# EAGLE design BMS Segment rev16 (EAGLE 9.6.2)
ENGINEER: Arvind Srinivasan

## Sheet 1 of 2: Lower 9 Cell Connections
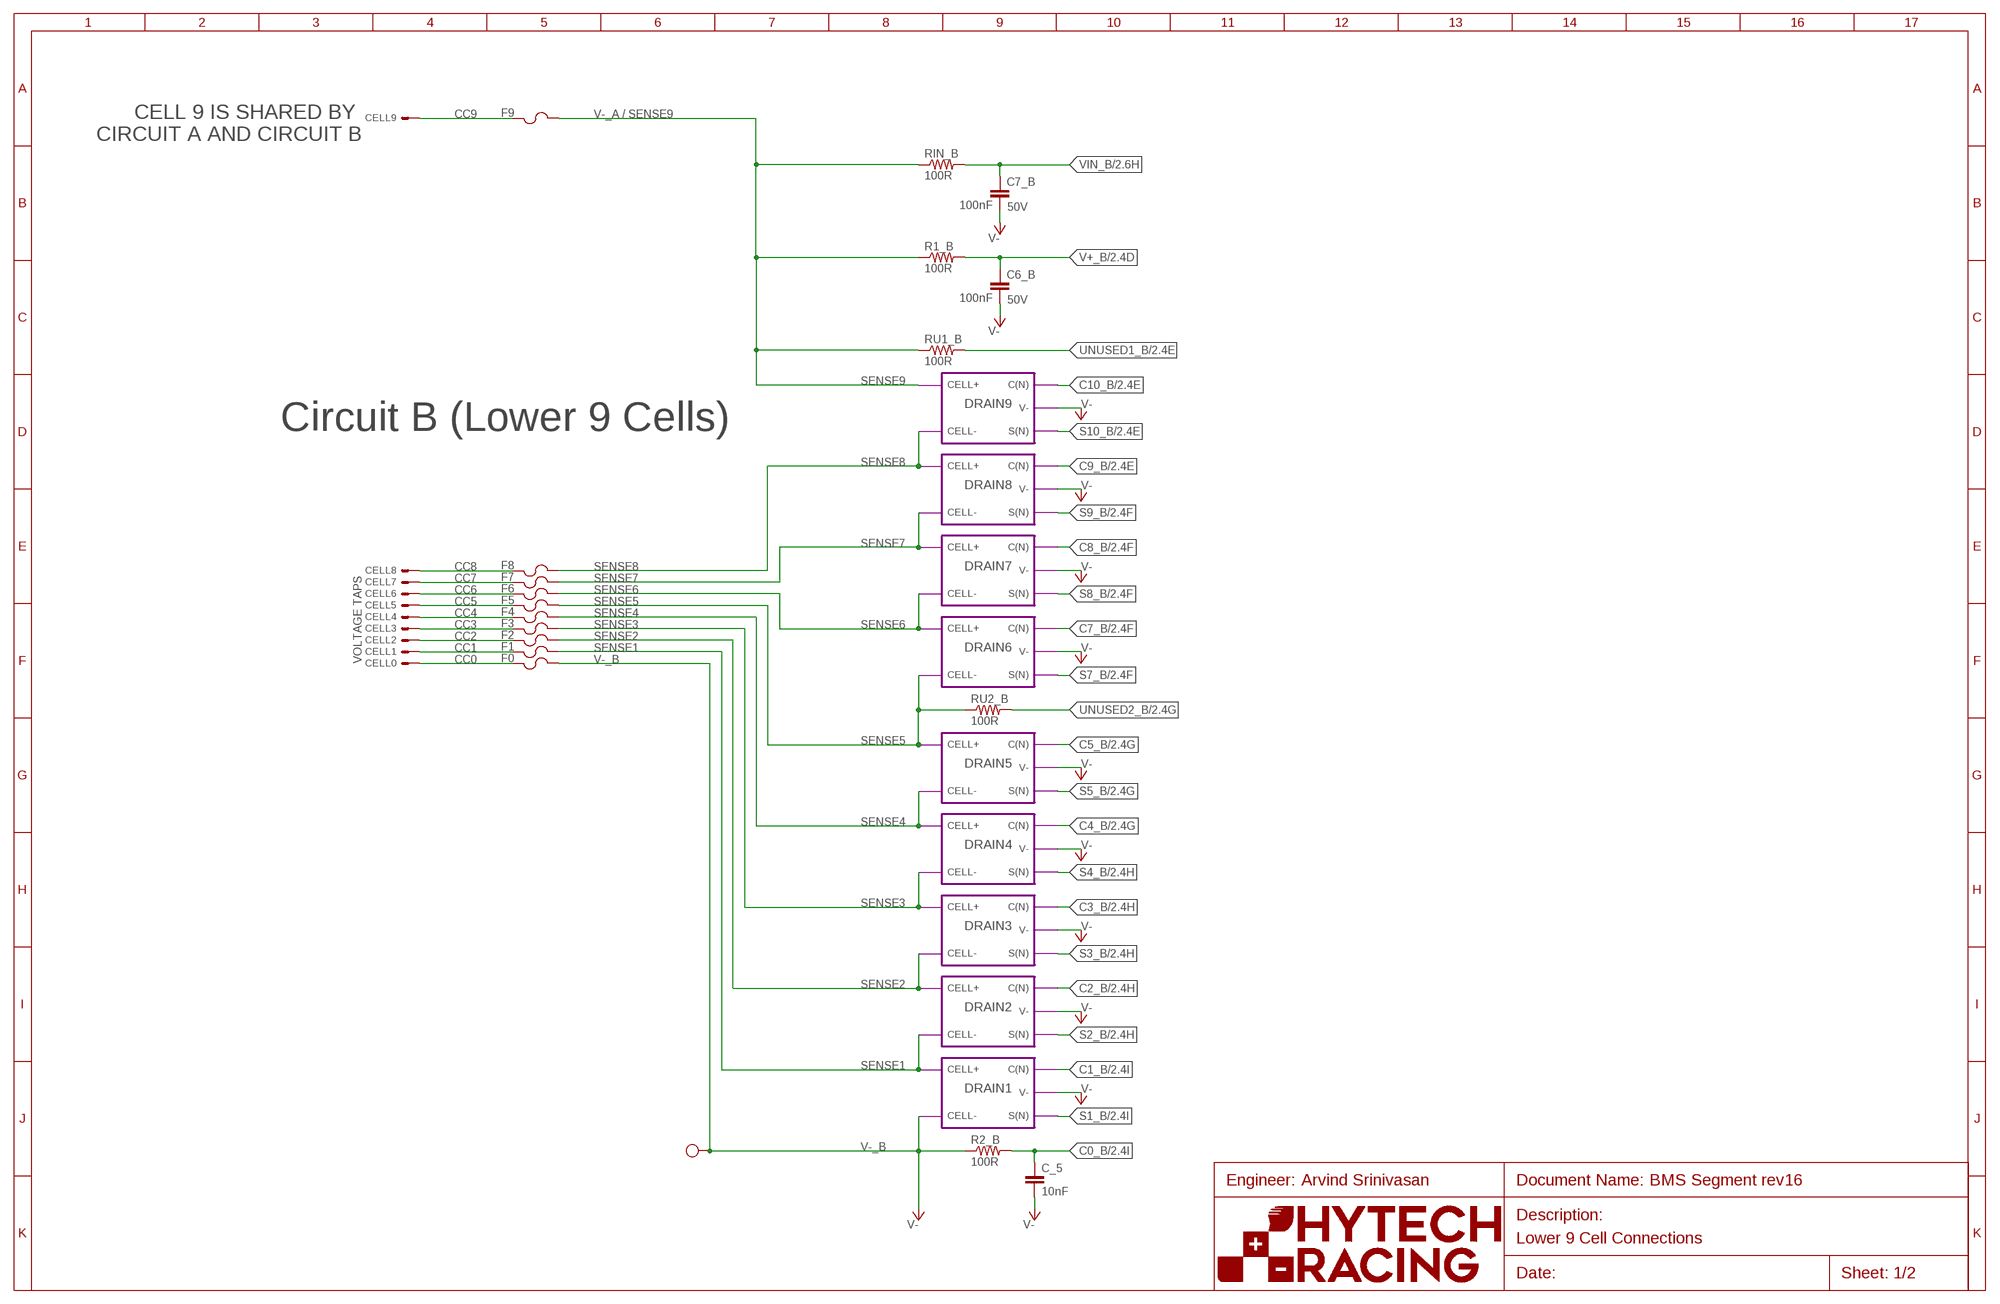
[diagram p0: schematic, sheet 1]
U$25 (FRAME_B): ENGINEER: Arvind Srinivasan; FRAME_DESCRIPTION: Lower 9 Cell Connections; ORIENTATION: LANDSCAPE; SIZE: B

### Parts
C6_B  100nF  CAP0603-CAP  [0603-CAP]
C7_B  100nF  CAP0603-CAP  [0603-CAP]
C_5  10nF  CAP0603-CAP  [0603-CAP]
CELL0  BATTERY_SPRING_SPRING_CONTACT  [CONTACT_SPRING]
CELL1  BATTERY_SPRING_SPRING_CONTACT  [CONTACT_SPRING]
CELL2  BATTERY_SPRING_SPRING_CONTACT  [CONTACT_SPRING]
CELL3  BATTERY_SPRING_SPRING_CONTACT  [CONTACT_SPRING]
CELL4  BATTERY_SPRING_SPRING_CONTACT  [CONTACT_SPRING]
CELL5  BATTERY_SPRING_SPRING_CONTACT  [CONTACT_SPRING]
CELL6  BATTERY_SPRING_SPRING_CONTACT  [CONTACT_SPRING]
CELL7  BATTERY_SPRING_SPRING_CONTACT  [CONTACT_SPRING]
CELL8  BATTERY_SPRING_SPRING_CONTACT  [CONTACT_SPRING]
CELL9  BATTERY_SPRING_SPRING_CONTACT  [CONTACT_SPRING]
F0  0001.2704.11  [5X20MM_FUSE]
F1  0001.2704.11  [5X20MM_FUSE]
F2  0001.2704.11  [5X20MM_FUSE]
F3  0001.2704.11  [5X20MM_FUSE]
F4  0001.2704.11  [5X20MM_FUSE]
F5  0001.2704.11  [5X20MM_FUSE]
F6  0001.2704.11  [5X20MM_FUSE]
F7  0001.2704.11  [5X20MM_FUSE]
F8  0001.2704.11  [5X20MM_FUSE]
F9  0001.2704.11  [5X20MM_FUSE]
R1_B  100R  RESISTOR0603-RES  [0603-RES]
R2_B  100R  RESISTOR0603-RES  [0603-RES]
RIN_B  100R  RESISTOR0603-RES  [0603-RES]
RU1_B  100R  RESISTOR0603-RES  [0603-RES]
RU2_B  100R  RESISTOR0603-RES  [0603-RES]
U$6  TEST_POINT  [TEST_POINT]

### Module instances
DRAIN1 = CELL_VOLTAGE_FILTER+DRAIN
DRAIN2 = CELL_VOLTAGE_FILTER+DRAIN
DRAIN3 = CELL_VOLTAGE_FILTER+DRAIN
DRAIN4 = CELL_VOLTAGE_FILTER+DRAIN
DRAIN5 = CELL_VOLTAGE_FILTER+DRAIN
DRAIN6 = CELL_VOLTAGE_FILTER+DRAIN
DRAIN7 = CELL_VOLTAGE_FILTER+DRAIN
DRAIN8 = CELL_VOLTAGE_FILTER+DRAIN
DRAIN9 = CELL_VOLTAGE_FILTER+DRAIN

### Nets
C0_B: C_5.1 R2_B.2 ; also sheet 2
C1_B: port DRAIN1.C(N) ; also sheet 2
C2_B: port DRAIN2.C(N) ; also sheet 2
C3_B: port DRAIN3.C(N) ; also sheet 2
C4_B: port DRAIN4.C(N) ; also sheet 2
C5_B: port DRAIN5.C(N) ; also sheet 2
C7_B: port DRAIN6.C(N) ; also sheet 2
C8_B: port DRAIN7.C(N) ; also sheet 2
C9_B: port DRAIN8.C(N) ; also sheet 2
C10_B: port DRAIN9.C(N) ; also sheet 2
CC0 [unfused_hv]: CELL0.P$1(S) F0.P$1
CC1 [unfused_hv]: CELL1.P$1(S) F1.P$1
CC2 [unfused_hv]: CELL2.P$1(S) F2.P$1
CC3 [unfused_hv]: CELL3.P$1(S) F3.P$1
CC4 [unfused_hv]: CELL4.P$1(S) F4.P$1
CC5 [unfused_hv]: CELL5.P$1(S) F5.P$1
CC6 [unfused_hv]: CELL6.P$1(S) F6.P$1
CC7 [unfused_hv]: CELL7.P$1(S) F7.P$1
CC8 [unfused_hv]: CELL8.P$1(S) F8.P$1
CC9 [unfused_hv]: CELL9.P$1(S) F9.P$1
S1_B: port DRAIN1.S(N) ; also sheet 2
S2_B: port DRAIN2.S(N) ; also sheet 2
S3_B: port DRAIN3.S(N) ; also sheet 2
S4_B: port DRAIN4.S(N) ; also sheet 2
S5_B: port DRAIN5.S(N) ; also sheet 2
S7_B: port DRAIN6.S(N) ; also sheet 2
S8_B: port DRAIN7.S(N) ; also sheet 2
S9_B: port DRAIN8.S(N) ; also sheet 2
S10_B: port DRAIN9.S(N) ; also sheet 2
SENSE1: F1.P$2 ; port DRAIN1.CELL+ DRAIN2.CELL-
SENSE2: F2.P$2 ; port DRAIN2.CELL+ DRAIN3.CELL-
SENSE3: F3.P$2 ; port DRAIN3.CELL+ DRAIN4.CELL-
SENSE4: F4.P$2 ; port DRAIN4.CELL+ DRAIN5.CELL-
SENSE5: F5.P$2 RU2_B.1 ; port DRAIN5.CELL+ DRAIN6.CELL-
SENSE6: F6.P$2 ; port DRAIN6.CELL+ DRAIN7.CELL-
SENSE7: F7.P$2 ; port DRAIN7.CELL+ DRAIN8.CELL-
SENSE8: F8.P$2 ; port DRAIN8.CELL+ DRAIN9.CELL-
UNUSED1_B: RU1_B.2 ; also sheet 2
UNUSED2_B: RU2_B.2 ; also sheet 2
V+_B: C6_B.1 R1_B.2 ; also sheet 2
V-_A: F9.P$2 R1_B.1 RIN_B.1 RU1_B.1 ; port DRAIN9.CELL+
V-_B: C6_B.2 C7_B.2 C_5.2 F0.P$2 R2_B.1 U$6.P$1 ; port DRAIN1.CELL- DRAIN9.V- DRAIN8.V- DRAIN7.V- DRAIN6.V- DRAIN5.V- DRAIN4.V- DRAIN3.V- DRAIN2.V- DRAIN1.V- ; supply symbol labelled V- ; also sheet 2
VIN_B: C7_B.1 RIN_B.2 ; also sheet 2

### Notes on the sheet
- V-_A / SENSE9
- CELL 9 IS SHARED BY 
  CIRCUIT A AND CIRCUIT B
- SENSE9
- Circuit B (Lower 9 Cells)
- VOLTAGE TAPS

## Sheet 2 of 2: Upper LTC6811 IC
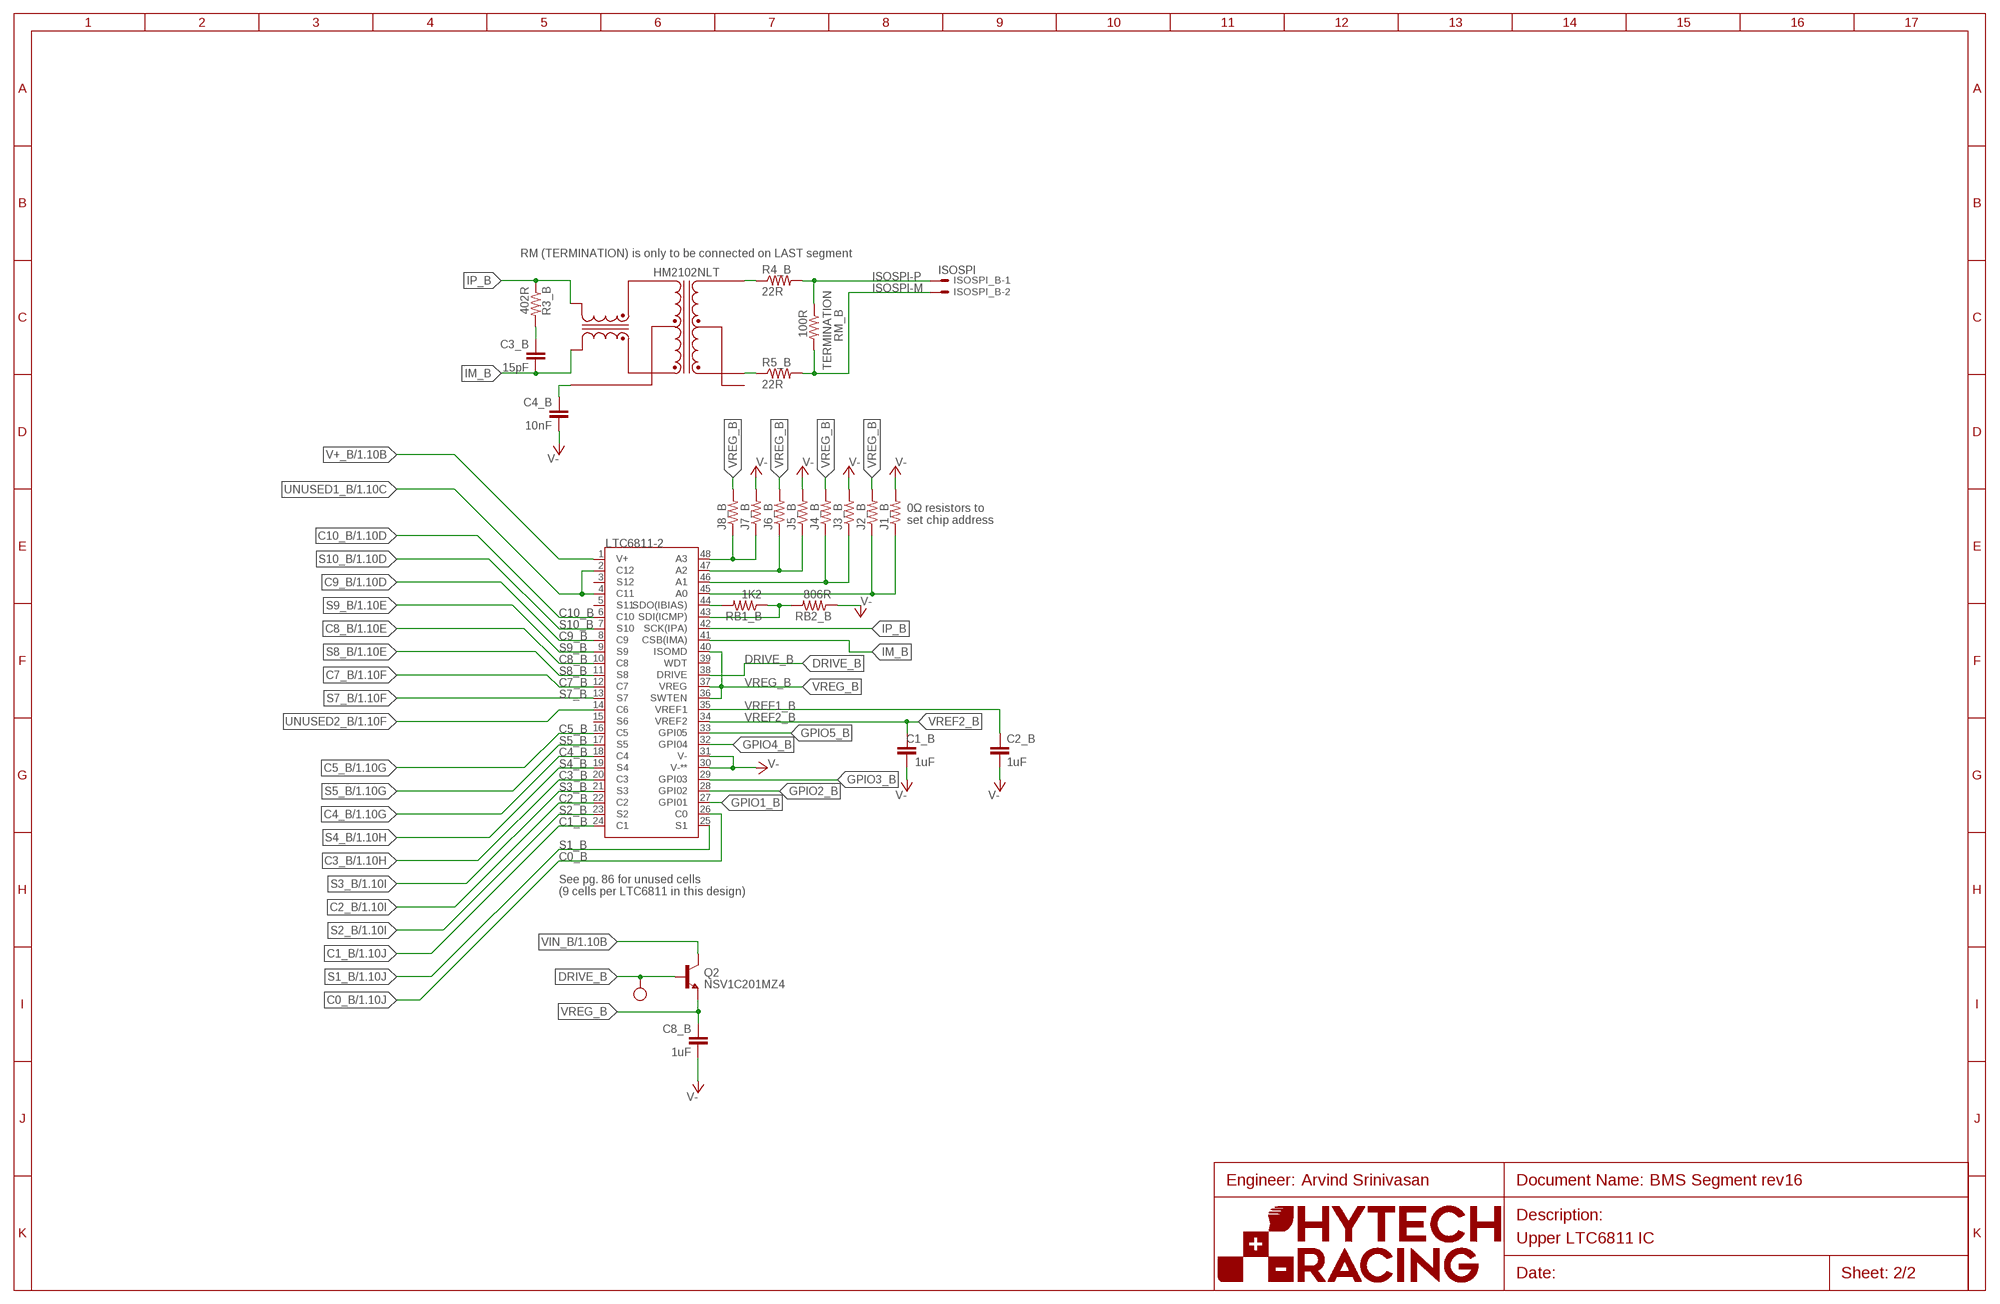
[diagram p1: schematic, sheet 2]
U$22 (FRAME_B): ENGINEER: Arvind Srinivasan; FRAME_DESCRIPTION: Upper LTC6811 IC; ORIENTATION: LANDSCAPE; SIZE: B

### Parts
C1_B  1uF  CAP0603-CAP  [0603-CAP]
C2_B  1uF  CAP0603-CAP  [0603-CAP]
C3_B  15pF  CAP0603-CAP  [0603-CAP]
C4_B  10nF  CAP0603-CAP  [0603-CAP]
C8_B  1uF  CAP0603-CAP  [0603-CAP]
ISOSPI_B  ISOSPI  CONNECTOR-2NANO-FIT_VERTICAL-2  [NANO-FIT_VERTICAL-2]
J1_B  0R  RESISTOR0603-RES  [0603-RES]
J2_B  0R  RESISTOR0603-RES  [0603-RES]
J3_B  0R  RESISTOR0603-RES  [0603-RES]
J4_B  0R  RESISTOR0603-RES  [0603-RES]
J5_B  0R  RESISTOR0603-RES  [0603-RES]
J6_B  0R  RESISTOR0603-RES  [0603-RES]
J7_B  0R  RESISTOR0603-RES  [0603-RES]
J8_B  0R  RESISTOR0603-RES  [0603-RES]
Q2  NSV1C201MZ4  [SOT223]
R3_B  402R  RESISTOR0603-RES  [0603-RES]
R4_B  22R  RESISTOR0603-RES  [0603-RES]
R5_B  22R  RESISTOR0603-RES  [0603-RES]
RB1_B  1K2  RESISTOR0603-RES  [0603-RES]
RB2_B  806R  RESISTOR0603-RES  [0603-RES]
RM_B  100R  RESISTOR0603-RES  [0603-RES]
TRANSFORMER  HM2102NLT  [HM2102NLT]
U2  LTC6811-2  [LTC6811]
U$7  TEST_POINT  [TEST_POINT]

### Nets
C0_B: U2.26(C0) ; also sheet 1
C1_B: U2.24(C1) ; also sheet 1
C2_B: U2.22(C2) ; also sheet 1
C3_B: U2.20(C3) ; also sheet 1
C4_B: U2.18(C4) ; also sheet 1
C5_B: U2.16(C5) ; also sheet 1
C7_B: U2.12(C7) ; also sheet 1
C8_B: U2.10(C8) ; also sheet 1
C9_B: U2.8(C9) ; also sheet 1
C10_B: U2.6(C10) ; also sheet 1
DRIVE_B: Q2.1(BASE) U2.38(DRIVE) U$7.P$1
GPIO1_B: U2.27(GPI01)
GPIO2_B: U2.28(GPI02)
GPIO3_B: U2.29(GPI03)
GPIO4_B: U2.32(GPI04)
GPIO5_B: U2.33(GPI05)
IM_B: C3_B.2 TRANSFORMER.P$12(TD+) U2.41(CSB(IMA))
IP_B: R3_B.1 TRANSFORMER.P$10(TD-) U2.42(SCK(IPA))
ISOSPI-M: ISOSPI_B.P$2 R5_B.2 RM_B.2
ISOSPI-P: ISOSPI_B.P$1 R4_B.2 RM_B.1
N$1: C4_B.1 TRANSFORMER.P$11(TCT)
N$2: RB1_B.2 U2.44(SDO(IBIAS))
N$4: RB1_B.1 RB2_B.2 U2.43(SDI(ICMP))
N$5: R4_B.1 TRANSFORMER.P$3(MX-)
N$7: R5_B.1 TRANSFORMER.P$1(MX+)
N$8: J7_B.1 J8_B.1 U2.48(A3)
N$9: J5_B.1 J6_B.1 U2.47(A2)
N$10: C3_B.1 R3_B.2
N$13: J3_B.1 J4_B.1 U2.46(A1)
N$16: J1_B.1 J2_B.1 U2.45(A0)
S1_B: U2.25(S1) ; also sheet 1
S2_B: U2.23(S2) ; also sheet 1
S3_B: U2.21(S3) ; also sheet 1
S4_B: U2.19(S4) ; also sheet 1
S5_B: U2.17(S5) ; also sheet 1
S7_B: U2.13(S7) ; also sheet 1
S8_B: U2.11(S8) ; also sheet 1
S9_B: U2.9(S9) ; also sheet 1
S10_B: U2.7(S10) ; also sheet 1
UNUSED1_B: U2.2(C12) U2.4(C11) ; also sheet 1
UNUSED2_B: U2.14(C6) ; also sheet 1
V+_B: U2.1(V+) ; also sheet 1
V-_B: C1_B.2 C2_B.2 C4_B.2 C8_B.2 J1_B.2 J3_B.2 J5_B.2 J7_B.2 RB2_B.1 U2.30(V-**) U2.31(V-) ; supply symbol labelled V- ; also sheet 1
VIN_B: Q2.2(COLLECTOR) Q2.4(COLLECTOR) ; also sheet 1
VREF1_B: C2_B.1 U2.35(VREF1)
VREF2_B: C1_B.1 U2.34(VREF2)
VREG_B: C8_B.1 J2_B.2 J4_B.2 J6_B.2 J8_B.2 Q2.3(EMITTER) U2.36(SWTEN) U2.37(VREG) U2.40(ISOMD)
Unconnected: TRANSFORMER.P$2(MCT) TRANSFORMER.P$4(MX+) TRANSFORMER.P$5(MCT) TRANSFORMER.P$6(MX-) TRANSFORMER.P$7(TD-) TRANSFORMER.P$8(TCT) TRANSFORMER.P$9(TD+) U2.3(S12) U2.5(S11) U2.15(S6) U2.39(WDT)

### Notes on the sheet
- RM (TERMINATION) is only to be connected on LAST segment
- 0Ω resistors to
  set chip address
- LTC6811-2
- See pg. 86 for unused cells
  (9 cells per LTC6811 in this design)

## Library data of the parts
C1_B C2_B C3_B C4_B C8_B C_5 = HyTechDevices:CAP: Capacitor Standard 0603 ceramic capacitor, and 0.1" leaded capacitor.; TOLERANCE: 5%; VOLTAGE: 10V
C6_B C7_B = HyTechDevices:CAP: Capacitor Standard 0603 ceramic capacitor, and 0.1" leaded capacitor.; TOLERANCE: 5%; VOLTAGE: 50V
CELL0 CELL1-CELL9 = HyTechDevices:BATTERY_SPRING: Keystone Electronics Battery Spring Contact Datasheet <http://keyelco.com/userAssets/file/M65p17.pdf> Mill-Max Pogo Pins Datasheet <https://www.mill-max.com/catalog/download/2019-08%3A019.6M.pdf>
F0 F1-F9 = HyTechDevices:0001.2704.11: Schurter Surface Mount Ceramic Fuse Current Rating: 1A Voltage Rating AC: 250 VAC Voltage Rating DC: 300 VDC Dimensions: 5 mm x 20 mm Datasheet <http://www.mouser.com/ds/2/358/typ_SMD-SPT-46594.pdf>; RATING: 1A
ISOSPI_B = HyTechDevices:CONNECTOR-2: Mini-Fit Junior connector 2 pole Source: http://www.molex.com
J1_B J2_B J3_B J4_B J5_B J6_B J7_B J8_B R1_B R2_B R3_B R4_B R5_B RB1_B RB2_B RIN_B RU1_B RU2_B = HyTechDevices:RESISTOR: Resistor Basic schematic elements and footprints for 0603, 1206, and PTH resistors.; TOLERANCE: 1%
Q2 = HyTechDevices:NSV1C201MZ4: NPN Transistor Datasheet <http://www.onsemi.com/pub/Collateral/NSS1C201MZ4-D.PDF> MAX current: 2.0A MAX voltage: 100V
RM_B = HyTechDevices:RESISTOR: Resistor Basic schematic elements and footprints for 0603, 1206, and PTH resistors.; TOLERANCE: 1%; TYPE: TERMINATION
TRANSFORMER = HyTechDevices:HM2102NLT: 2 Channel SMT Transformer Turns ratio: 1CT: 1CT Isolation Voltage: 4300 VDC Inductance: 150 uH Leakage Inductance: 0.50 uH max DataSheet <https://www.mouser.com/datasheet/2/336/HM2102NL-1218600.pdf>
U2 = HyTechDevices:LTC6811-2: Linear Technology Multicell Battery Stack Monitor Variant 2: Addressable/Multi-Drop Configuration Datasheet <http://cds.linear.com/docs/en/datasheet/680412fc.pdf>
U$6 U$7 = HyTechDevices:TEST_POINT: Keystone Electronics Test Point 5005

## Module CELL_VOLTAGE_FILTER+DRAIN
Ports: CELL+(in) CELL-(pas) S(N)(in) C(N)(out) V-(pwr)
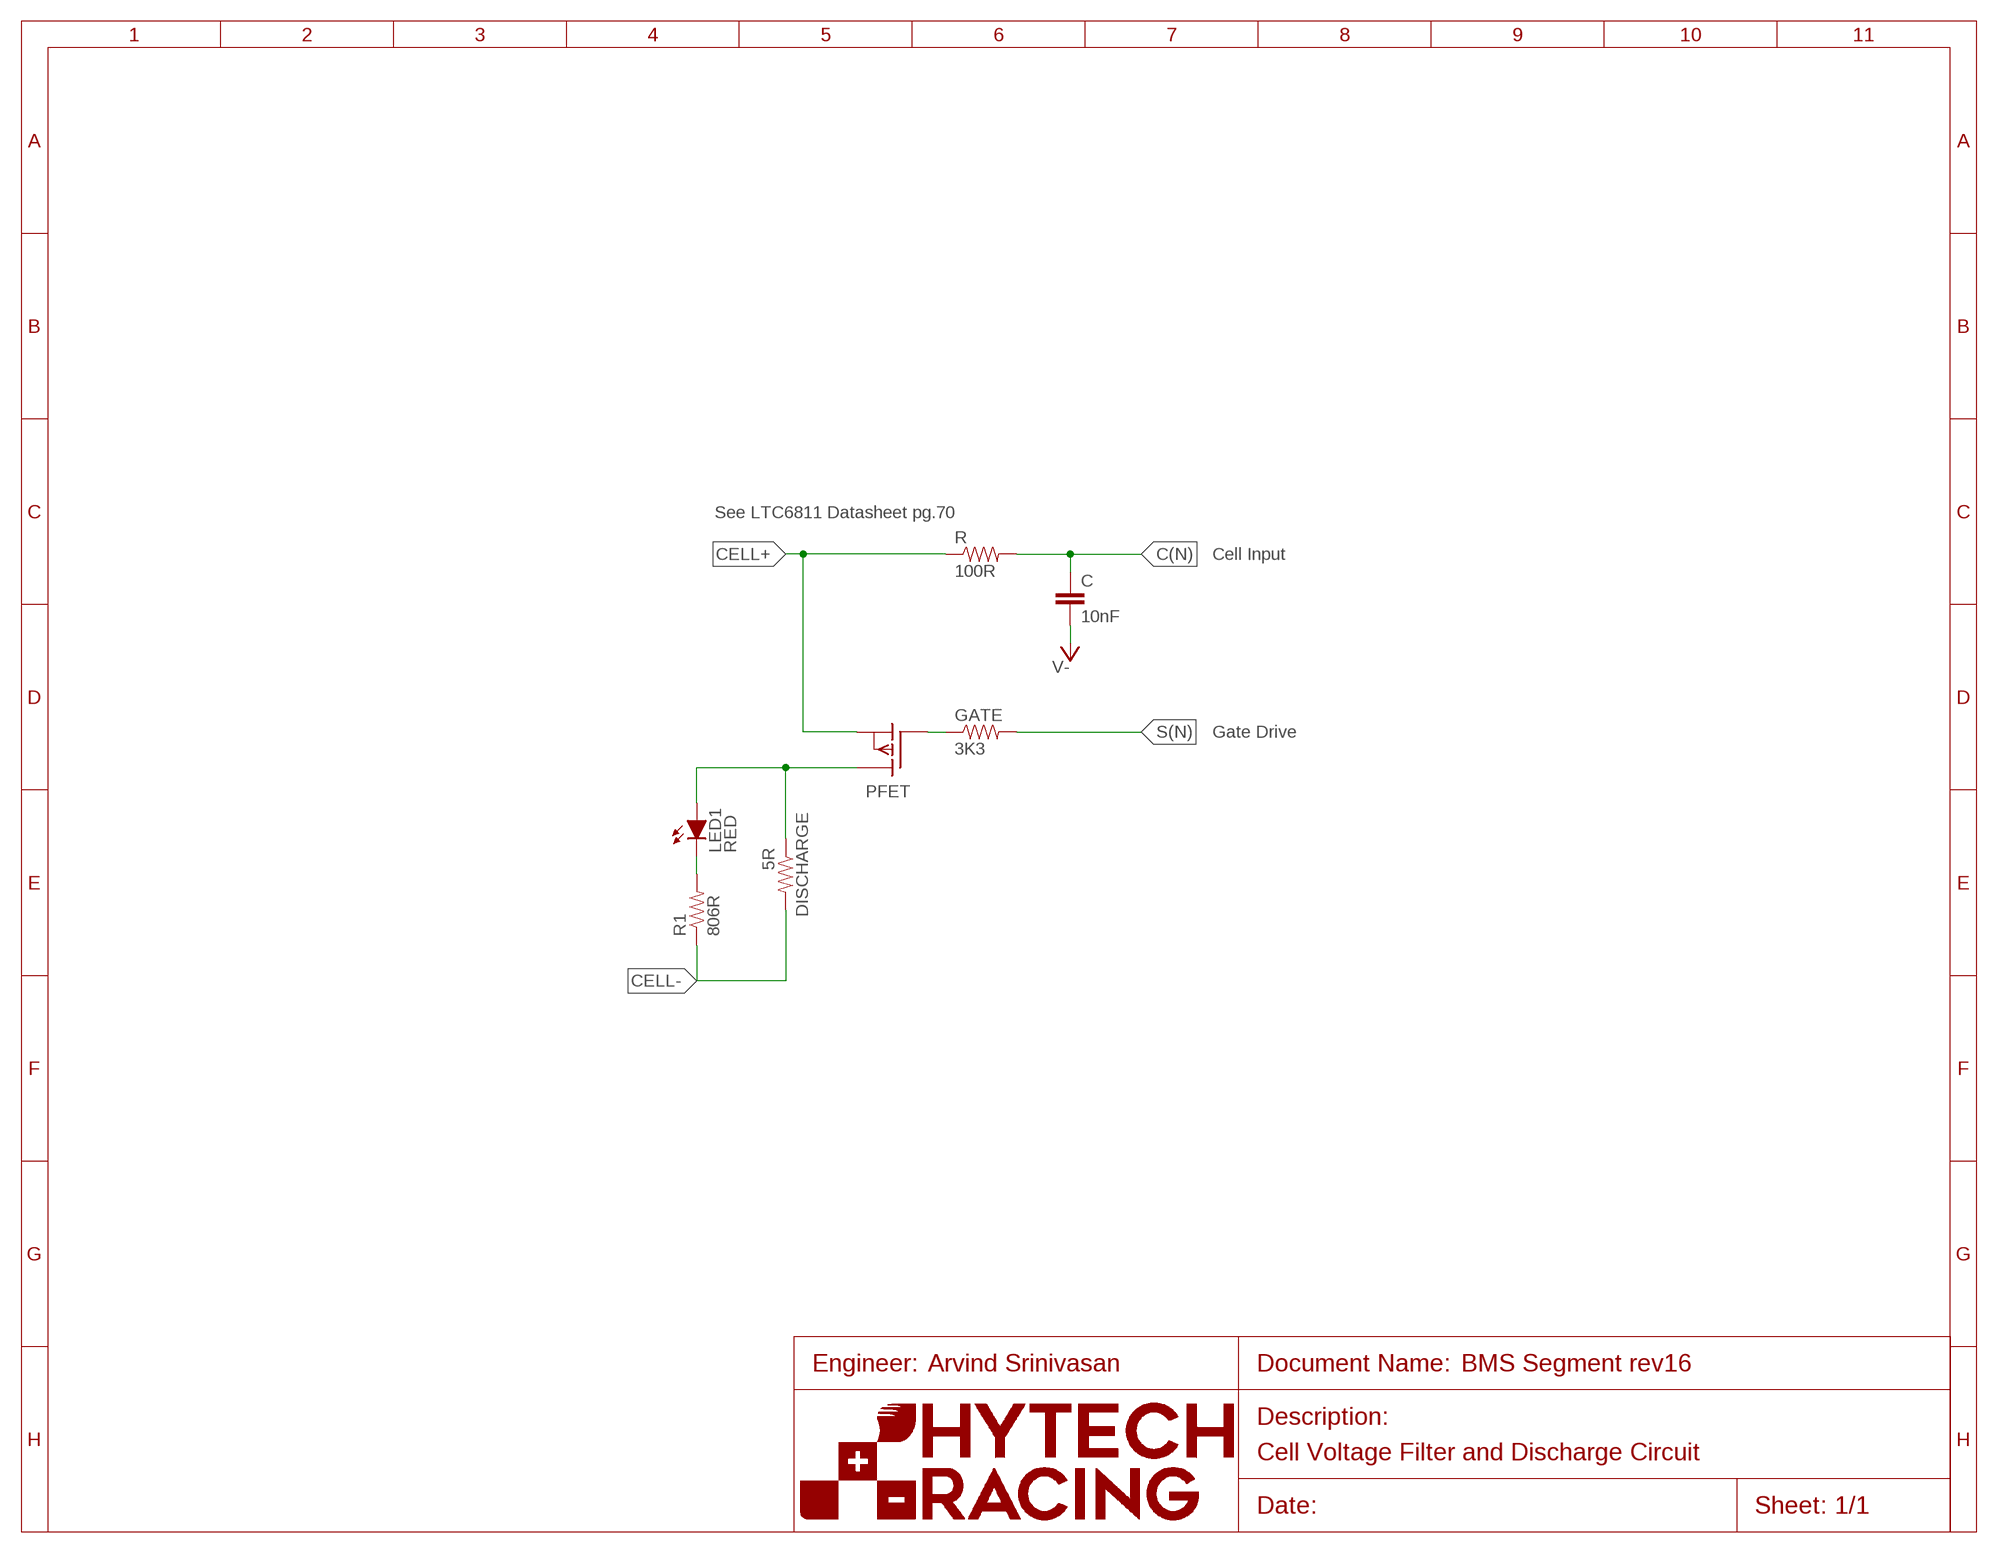
[diagram p2: schematic, module CELL_VOLTAGE_FILTER+DRAIN, sheet 1]
U$1 (FRAME_A): FRAME_DESCRIPTION: Default; ORIENTATION: LANDSCAPE; SIZE: A

### Parts
C  10nF  CAP0603-CAP  [0603-CAP]
DISCHARGE  5R  RESISTORPWR163  [PWR163]
GATE  3K3  RESISTOR0603-RES  [0603-RES]
LED1  RED  LED-0603  [LED-603]
PFET  P-CHANNEL_MOSFET_DMP3099L-7  [SOT23]
R  100R  RESISTOR0603-RES  [0603-RES]
R1  806R  RESISTOR0603-RES  [0603-RES]

### Nets
C(N): C.1 R.2
CELL+: PFET.2(S) R.1
CELL-: DISCHARGE.2 R1.1
GATE: GATE.1 PFET.1(G)
N$1: DISCHARGE.1 LED1.A PFET.3(D)
N$2: LED1.C R1.2
S(N): GATE.2
V-: C.2

### Notes on the sheet
- See LTC6811 Datasheet pg.70
- Cell Input
- Gate Drive
- Arvind Srinivasan
- Cell Voltage Filter and Discharge Circuit

### Library data of the parts
C = HyTechDevices:CAP: Capacitor Standard 0603 ceramic capacitor, and 0.1" leaded capacitor.; TOLERANCE: 5%; VOLTAGE: 10V
DISCHARGE = HyTechDevices:RESISTOR: Resistor Basic schematic elements and footprints for 0603, 1206, and PTH resistors.; TOLERANCE: 5%
GATE R R1 = HyTechDevices:RESISTOR: Resistor Basic schematic elements and footprints for 0603, 1206, and PTH resistors.; TOLERANCE: 1%
LED1 = HyTechDevices:LED: Light Emitting Diode (LED) Source: Dangerous Prototypes Eagle Library <https://github.com/DangerousPrototypes/Eagle_Part_Library>; DKPN: 350-2038-1-ND
PFET = HyTechDevices:P-CHANNEL_MOSFET_DMP3099L-7: Diodes Incorporated P-Channel Enhancement Mode MOSFET Datasheet <http://www.mouser.com/ds/2/115/DMP3099L-266220.pdf>

## Module CELL_THERM_FILTER
Ports: VREF(pwr) GPIO(out) THERM(in) V-(pwr)
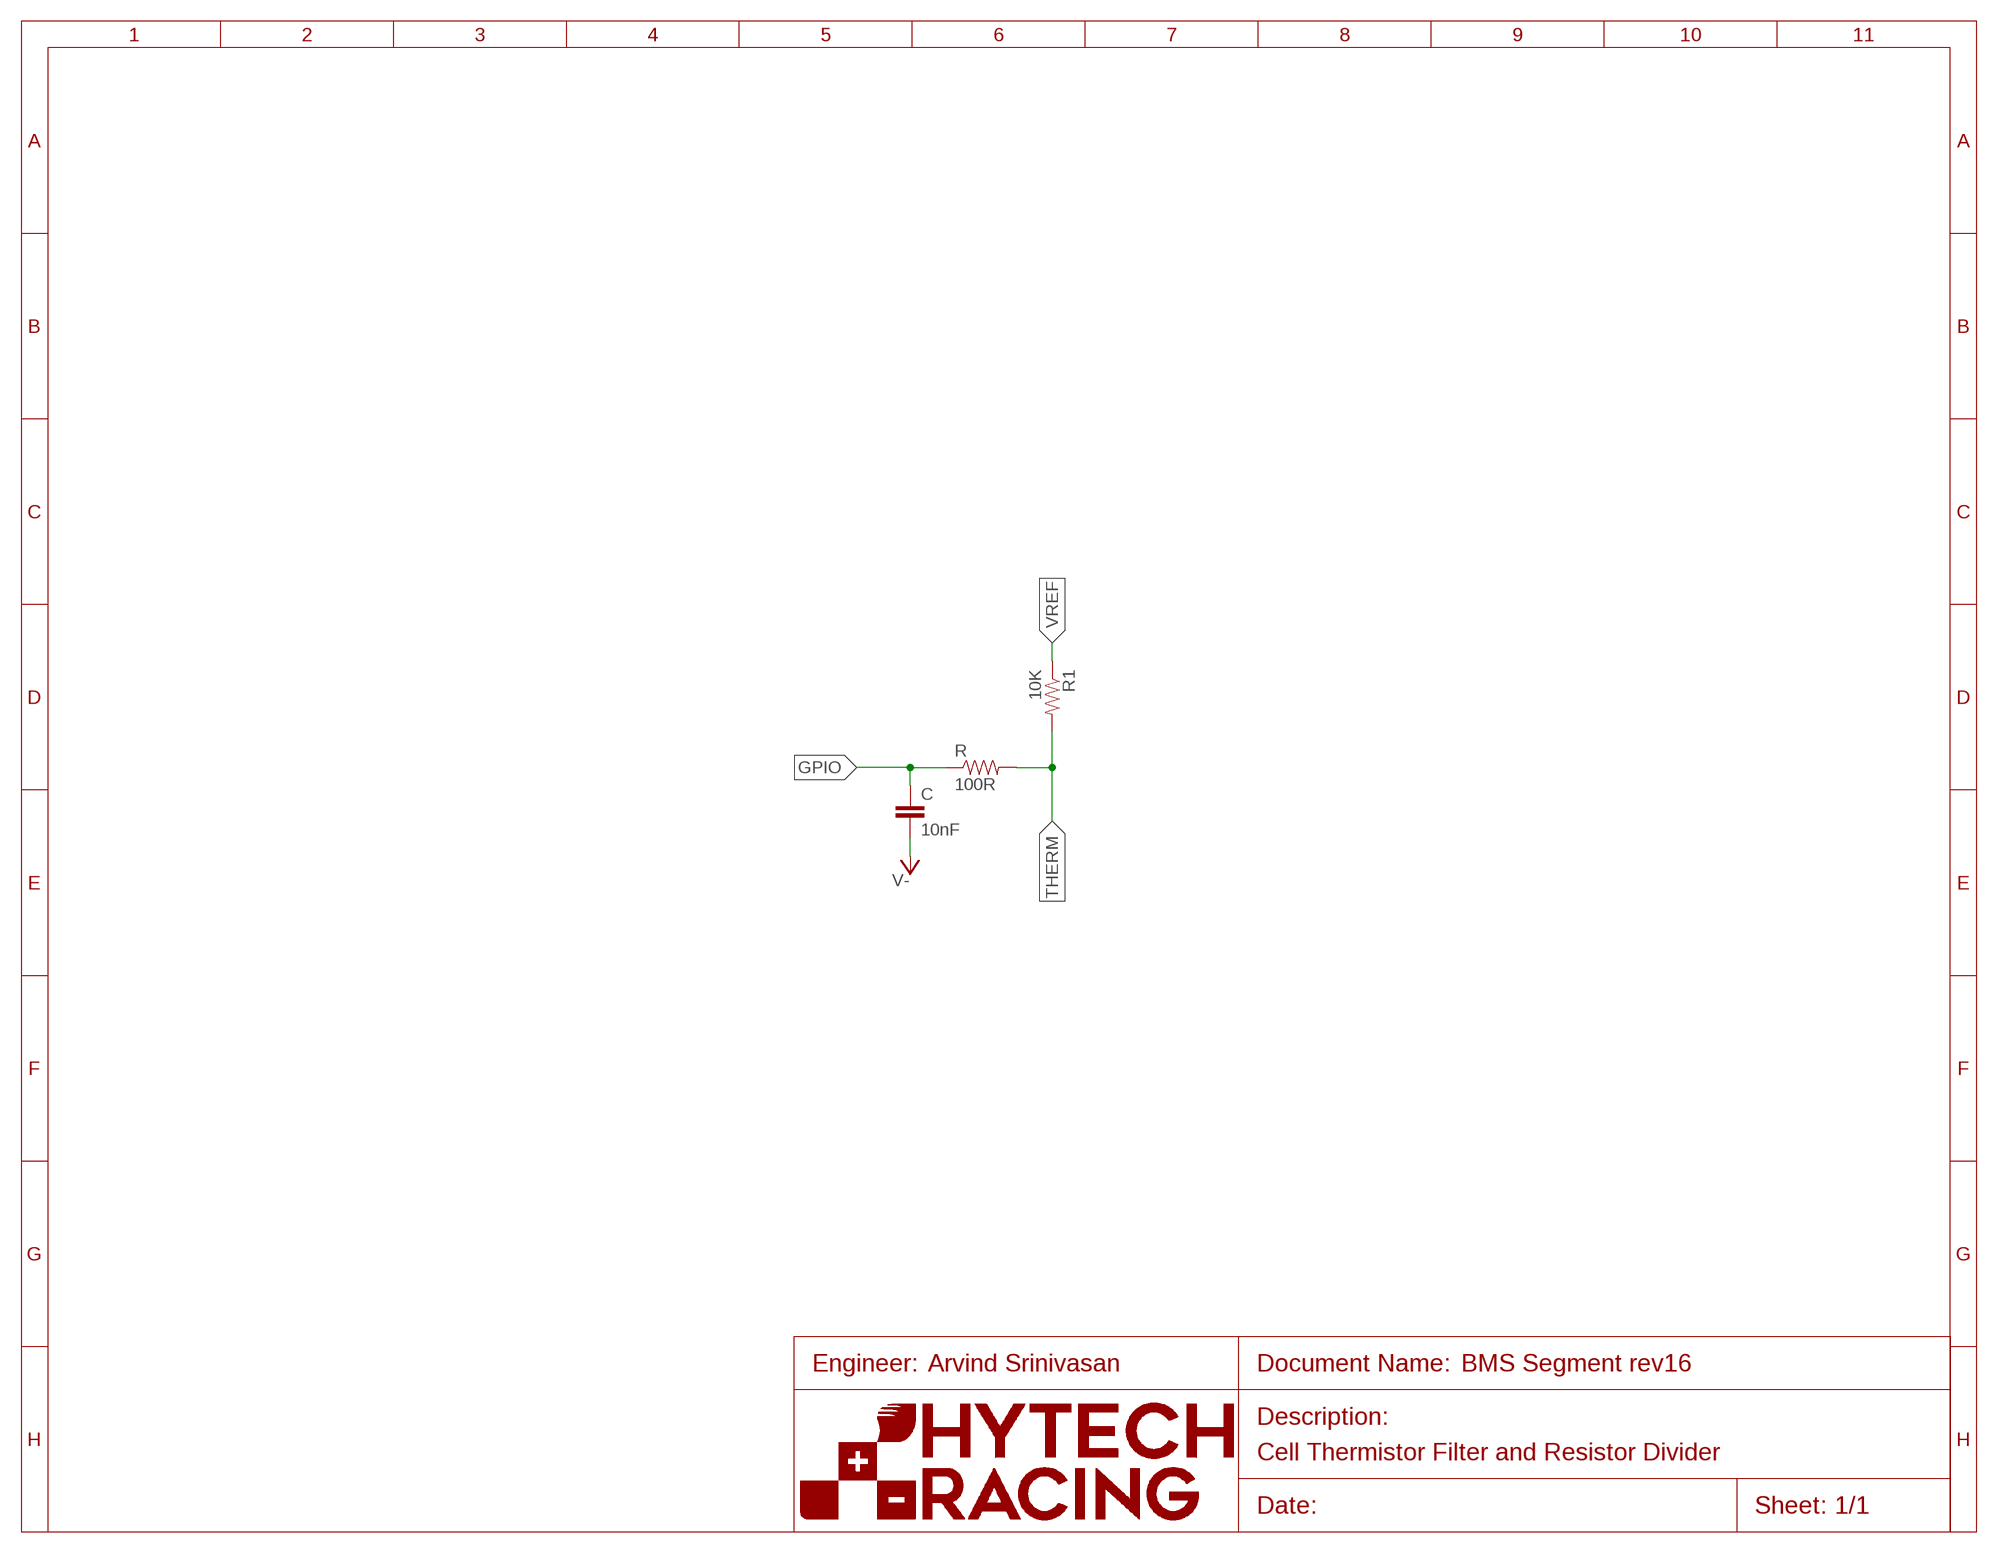
[diagram p3: schematic, module CELL_THERM_FILTER, sheet 1]
U$1 (FRAME_A): FRAME_DESCRIPTION: Default; ORIENTATION: LANDSCAPE; SIZE: A

### Parts
C  10nF  CAP0603-CAP  [0603-CAP]
R  100R  RESISTOR0603-RES  [0603-RES]
R1  10K  RESISTOR0603-RES  [0603-RES]

### Nets
GPIO: C.1 R.1
THERM: R1.2 R.2
V-: C.2
VREF: R1.1

### Notes on the sheet
- Arvind Srinivasan
- Cell Thermistor Filter and Resistor Divider

### Library data of the parts
C = HyTechDevices:CAP: Capacitor Standard 0603 ceramic capacitor, and 0.1" leaded capacitor.; TOLERANCE: 5%; VOLTAGE: 10V
R R1 = HyTechDevices:RESISTOR: Resistor Basic schematic elements and footprints for 0603, 1206, and PTH resistors.; TOLERANCE: 1%

## Net classes
1 unfused_hv: clearance 0.025 mm to class 0, clearance 3.2 mm

## Board
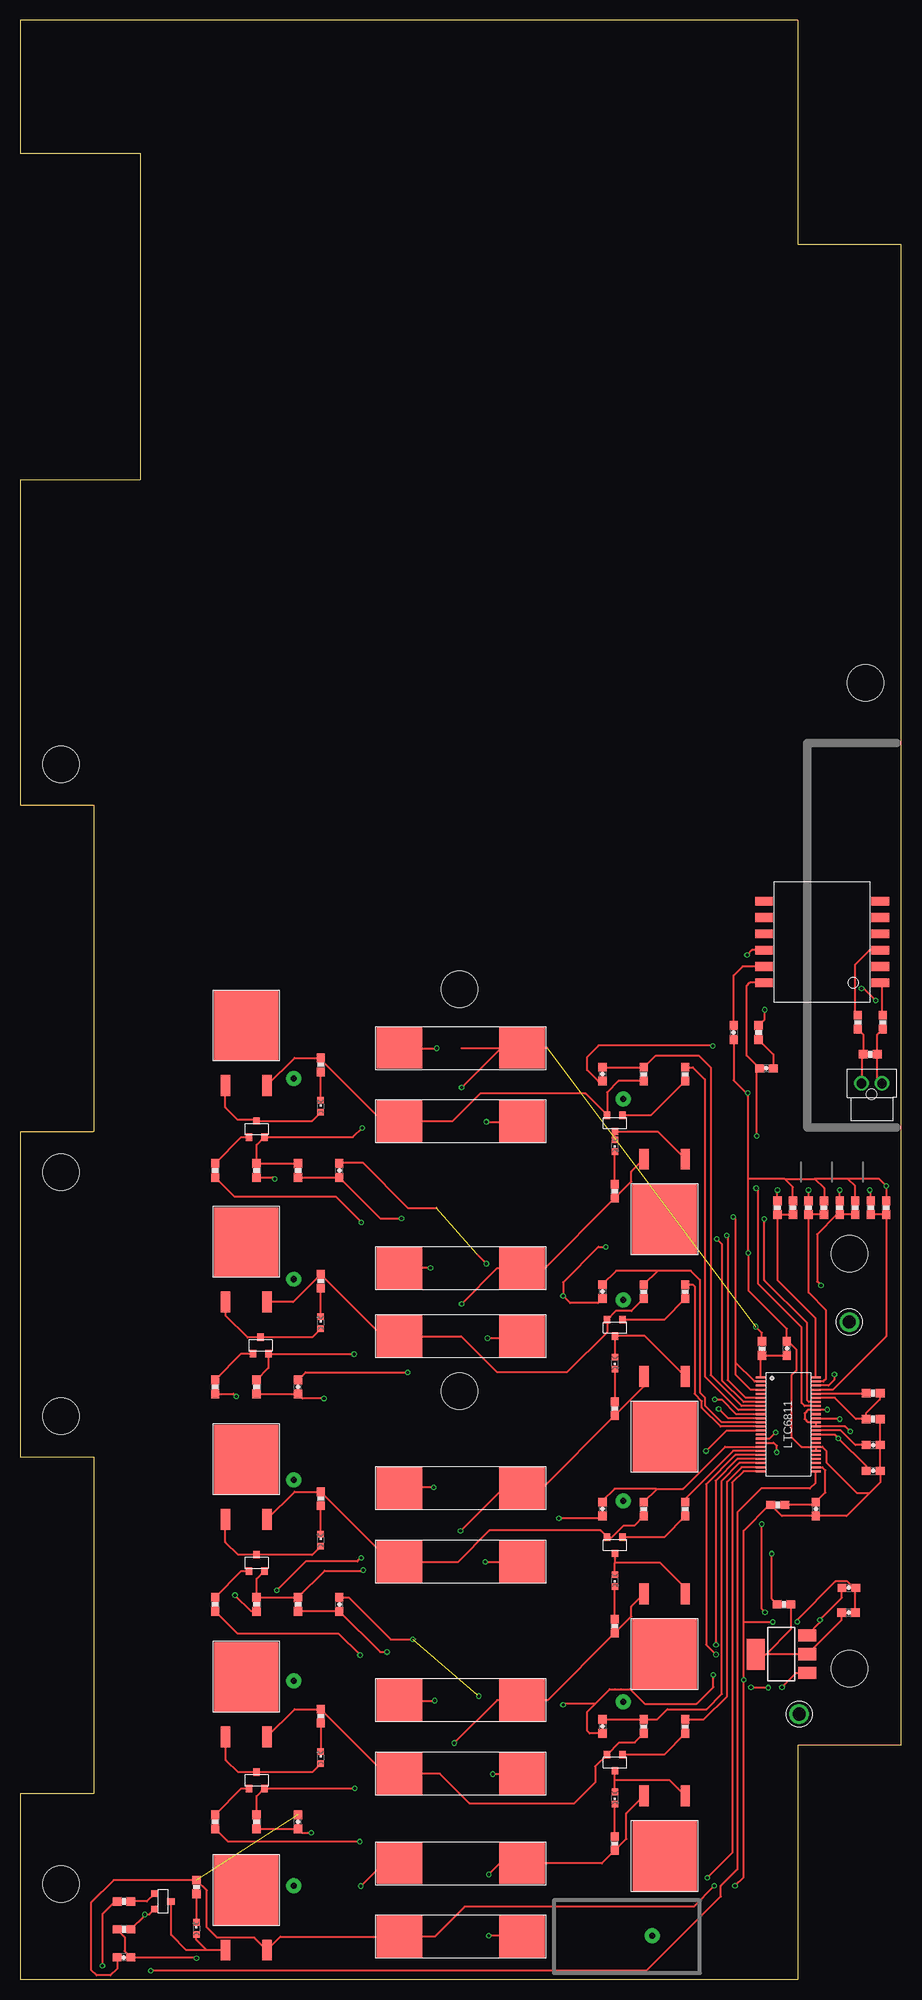
[diagram p4: board, top side]
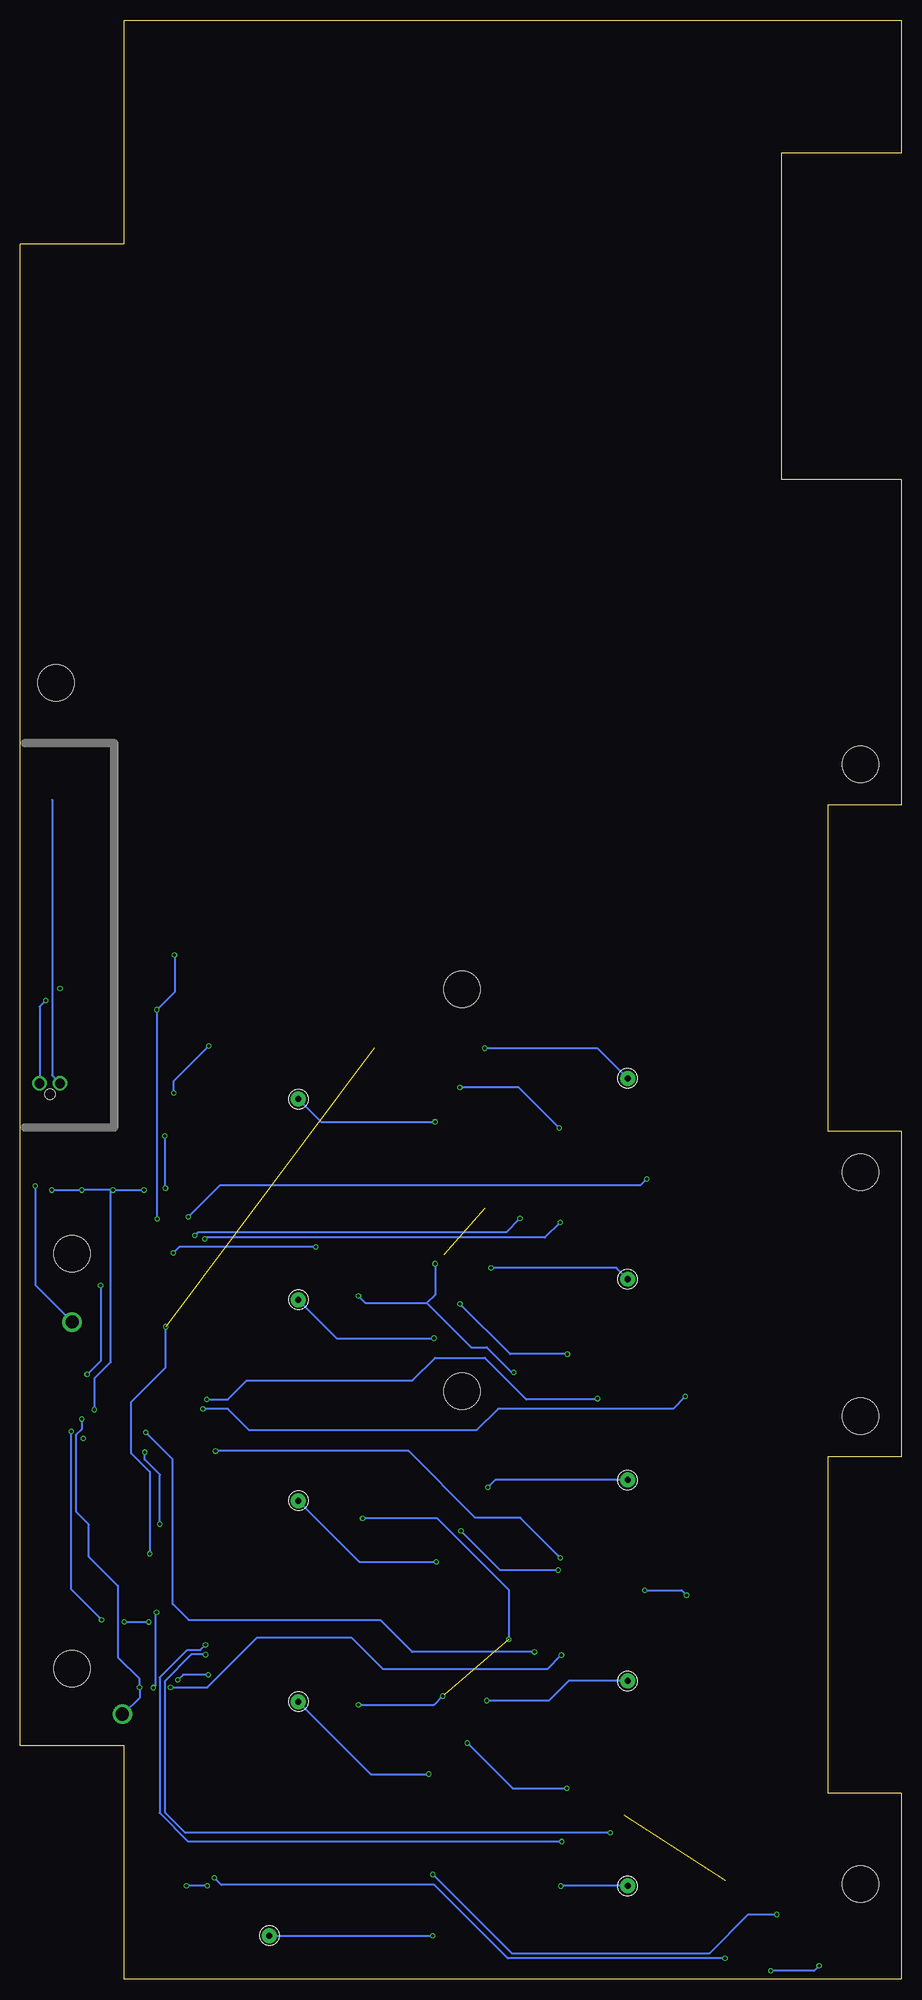
[diagram p5: board, bottom side, seen from below]

Size 108 x 240.25 mm. Coordinates in mm from the lower left corner, seen from the top.
Outline: 14.71,223.93 14.71,183.93 0,183.93 0,143.99 9,143.99 9,103.99 0,103.99 0,64.05 9,64.05 9,22.77 0,22.77 0,0 95.3,0 95.3,28.7 108,28.7 108,212.82 95.3,212.82 95.3,240.25 0,240.25 0,223.93 14.71,223.93
Copper layers (1*16): Top 0.035mm / dielectric 1.5mm / Bottom 0.035mm
Design rules "Advanced Circuits (2 Layer) *": minimum track width 5mil, minimum drill 10mil, track to track 5mil, track to pad 5mil, pad to pad 5mil, via to via 5mil, smd to smd 5mil, copper to edge 10mil, drill to drill 6mil, minimum pad ring 7mil, minimum via ring 5mil, stop-mask expansion 2.5mil, vias tented up to drill 30mil, thermal gap 10mil

### Footprints (pad centres in the part's own frame; a part is rotated, then mirrored left to right if it is on the bottom)
0603-CAP = smd 1.1 x 1: 1 -0.85,0; 2 0.85,0
CONTACT_SPRING = drill 0.737 pad 1.829: P$1 0,0
PWR163 = smd 1.143 x 2.54: 1 -2.54,-7.366; 2 2.54,-7.366 | smd 7.874 x 8.509: PAD 0,0
0603-RES = smd 1.1 x 1: 1 -0.85,0; 2 0.85,0
LED-603 = smd 0.8 x 0.8: A 0,-0.75; C 0,0.75
SOT23 = smd 0.8 x 0.9: 1 -0.95,-1; 2 0.95,-1; 3 0,1
5X20MM_FUSE = smd 5.588 x 5.08: P$1 -7.493,0; P$2 7.493,0
NANO-FIT_VERTICAL-2 = drill 1.2: P$1 -1.25,0; P$2 1.25,0 | hole 1.3: 0,-1.34
SOT223 = smd 1.5 x 2.235: 1 -2.3,-3.15; 2 0,-3.15; 3 2.3,-3.15 | smd 3.8 x 2.2: 4 0,3.15
HM2102NLT = smd 1.067 x 2.184: P$1 0,0; P$2 2,0; P$3 4,0; P$4 6,0; P$5 8,0; P$6 10,0; P$7 10,14.25; P$8 8,14.25; P$9 6,14.25; P$10 4,14.25; P$11 2,14.25; P$12 0,14.25
LTC6811 = smd 0.25 x 1.25: 1 -5.75,-3.37; 2 -5.25,-3.37; 3 -4.75,-3.37; 4 -4.25,-3.37; 5 -3.75,-3.37; 6 -3.25,-3.37; 7 -2.75,-3.37; 8 -2.25,-3.37; 9 -1.75,-3.37; 10 -1.25,-3.37; 11 -0.75,-3.37; 12 -0.25,-3.37; 13 0.25,-3.37; 14 0.75,-3.37; 15 1.25,-3.37; 16 1.75,-3.37; 17 2.25,-3.37; 18 2.75,-3.37; 19 3.25,-3.37; 20 3.75,-3.37; 21 4.25,-3.37; 22 4.75,-3.37; 23 5.25,-3.37; 24 5.75,-3.37; 25 5.75,3.38; 26 5.25,3.38; 27 4.75,3.38; 28 4.25,3.38; 29 3.75,3.38; 30 3.25,3.38; 31 2.75,3.38; 32 2.25,3.38; 33 1.75,3.38; 34 1.25,3.38; 35 0.75,3.38; 36 0.25,3.38; 37 -0.25,3.38; 38 -0.75,3.38; 39 -1.25,3.38; 40 -1.75,3.38; 41 -2.25,3.38; 42 -2.75,3.38; 43 -3.25,3.38; 44 -3.75,3.38; 45 -4.25,3.38; 46 -4.75,3.38; 47 -5.25,3.38; 48 -5.75,3.38
TEST_POINT = drill 1.6: P$1 0,0
M4_MOUNTING = hole 4.5: 0,0

### Placement (x,y rotation side)
C1_B  104.56,62.34 0 top
C2_B  104.56,65.52 0 top
C3_B  91.49,111.7 180 top
C4_B  87.46,116.11 270 top
C6_B  93.98,77.34 90 top
C7_B  101.55,44.96 0 top
C8_B  101.6,48.01 0 top
C_5  97.54,57.66 270 top
CELL0  77.47,5.33 270 bottom
CELL1  33.53,11.43 270 bottom
CELL2  73.91,34.04 270 bottom
CELL3  33.53,36.58 270 bottom
CELL4  73.91,58.67 270 bottom
CELL5  33.53,61.21 270 bottom
CELL6  73.91,83.31 270 bottom
CELL7  33.53,85.85 270 bottom
CELL8  73.91,107.95 270 bottom
CELL9  33.53,110.49 270 bottom
DRAIN1:C  10nF  [0603-CAP]  12.7,2.67 180 top
DRAIN1:DISCHARGE  5R  [PWR163]  27.69,10.92 0 top
DRAIN1:GATE  3K3  [0603-RES]  12.7,9.53 180 top
DRAIN1:LED1  RED  [LED-603]  21.59,6.22 0 top
DRAIN1:PFET  P-CHANNEL_MOSFET_DMP3099L-7  [SOT23]  17.48,9.53 270 top
DRAIN1:R  100R  [0603-RES]  12.7,6.1 180 top
DRAIN1:R1  806R  [0603-RES]  21.59,11.3 270 top
DRAIN2:C  10nF  [0603-CAP]  71.37,30.99 270 top
DRAIN2:DISCHARGE  5R  [PWR163]  79,15.11 180 top
DRAIN2:GATE  3K3  [0603-RES]  81.53,30.99 90 top
DRAIN2:LED1  RED  [LED-603]  72.9,22.23 180 top
DRAIN2:PFET  P-CHANNEL_MOSFET_DMP3099L-7  [SOT23]  72.9,26.54 180 top
DRAIN2:R  100R  [0603-RES]  76.45,30.99 90 top
DRAIN2:R1  806R  [0603-RES]  72.9,16.64 90 top
DRAIN3:C  10nF  [0603-CAP]  34.04,19.3 90 top
DRAIN3:DISCHARGE  5R  [PWR163]  27.69,37.08 0 top
DRAIN3:GATE  3K3  [0603-RES]  23.88,19.3 270 top
DRAIN3:LED1  RED  [LED-603]  36.83,27.18 0 top
DRAIN3:PFET  P-CHANNEL_MOSFET_DMP3099L-7  [SOT23]  28.96,24.38 0 top
DRAIN3:R  100R  [0603-RES]  28.96,19.3 270 top
DRAIN3:R1  806R  [0603-RES]  36.83,32.26 270 top
DRAIN4:C  10nF  [0603-CAP]  71.37,57.66 270 top
DRAIN4:DISCHARGE  5R  [PWR163]  78.99,39.88 180 top
DRAIN4:GATE  3K3  [0603-RES]  81.53,57.66 90 top
DRAIN4:LED1  RED  [LED-603]  72.9,48.9 180 top
DRAIN4:PFET  P-CHANNEL_MOSFET_DMP3099L-7  [SOT23]  72.9,53.21 180 top
DRAIN4:R  100R  [0603-RES]  76.45,57.66 90 top
DRAIN4:R1  806R  [0603-RES]  72.9,43.31 90 top
DRAIN5:C  10nF  [0603-CAP]  39.12,45.97 90 top
DRAIN5:DISCHARGE  5R  [PWR163]  27.69,63.75 0 top
DRAIN5:GATE  3K3  [0603-RES]  23.88,45.97 270 top
DRAIN5:LED1  RED  [LED-603]  36.83,53.85 0 top
DRAIN5:PFET  P-CHANNEL_MOSFET_DMP3099L-7  [SOT23]  28.96,51.05 0 top
DRAIN5:R  100R  [0603-RES]  34.04,45.97 270 top
DRAIN5:R1  806R  [0603-RES]  36.83,58.93 270 top
DRAIN6:C  10nF  [0603-CAP]  71.37,84.33 270 top
DRAIN6:DISCHARGE  5R  [PWR163]  79,66.55 180 top
DRAIN6:GATE  3K3  [0603-RES]  81.53,84.33 90 top
DRAIN6:LED1  RED  [LED-603]  72.9,75.56 180 top
DRAIN6:PFET  P-CHANNEL_MOSFET_DMP3099L-7  [SOT23]  72.9,79.88 180 top
DRAIN6:R  100R  [0603-RES]  76.45,84.33 90 top
DRAIN6:R1  806R  [0603-RES]  72.9,69.98 90 top
DRAIN7:C  10nF  [0603-CAP]  34.04,72.64 90 top
DRAIN7:DISCHARGE  5R  [PWR163]  27.69,90.42 0 top
DRAIN7:GATE  3K3  [0603-RES]  23.88,72.64 270 top
DRAIN7:LED1  RED  [LED-603]  36.83,80.52 0 top
DRAIN7:PFET  P-CHANNEL_MOSFET_DMP3099L-7  [SOT23]  29.46,77.72 0 top
DRAIN7:R  100R  [0603-RES]  28.96,72.64 270 top
DRAIN7:R1  806R  [0603-RES]  36.83,85.6 270 top
DRAIN8:C  10nF  [0603-CAP]  71.37,111 270 top
DRAIN8:DISCHARGE  5R  [PWR163]  78.99,93.22 180 top
DRAIN8:GATE  3K3  [0603-RES]  81.53,111 90 top
DRAIN8:LED1  RED  [LED-603]  72.9,102.23 180 top
DRAIN8:PFET  P-CHANNEL_MOSFET_DMP3099L-7  [SOT23]  72.9,104.97 180 top
DRAIN8:R  100R  [0603-RES]  76.45,111 90 top
DRAIN8:R1  806R  [0603-RES]  72.9,96.65 90 top
DRAIN9:C  10nF  [0603-CAP]  39.12,99.19 90 top
DRAIN9:DISCHARGE  5R  [PWR163]  27.69,116.97 0 top
DRAIN9:GATE  3K3  [0603-RES]  23.88,99.19 270 top
DRAIN9:LED1  RED  [LED-603]  36.83,107.06 0 top
DRAIN9:PFET  P-CHANNEL_MOSFET_DMP3099L-7  [SOT23]  28.96,104.27 0 top
DRAIN9:R  100R  [0603-RES]  34.04,99.19 270 top
DRAIN9:R1  806R  [0603-RES]  36.83,112.14 270 top
F0  54,5.21 180 top
F1  54,14.21 0 top
F2  54,25.21 180 top
F3  54,34.21 0 top
F4  54,51.21 180 top
F5  54,60.21 0 top
F6  54,78.84 180 top
F7  54,87.21 0 top
F8  54,105.21 180 top
F9  54,114.21 0 top
ISOSPI_B  104.39,109.87 0 top
J1_B  106.17,94.61 90 top
J2_B  104.27,94.61 90 top
J3_B  102.36,94.61 90 top
J4_B  100.46,94.61 90 top
J5_B  98.55,94.61 90 top
J6_B  96.65,94.61 90 top
J7_B  94.74,94.61 90 top
J8_B  92.84,94.61 90 top
Q2  93.32,39.86 90 top
R1_B  90.93,77.34 270 top
R2_B  92.88,58.17 0 top
R3_B  90.51,116.11 270 top
R4_B  102.7,117.38 270 top
R5_B  105.75,117.38 270 top
RB1_B  104.56,71.87 180 top
RB2_B  104.56,68.69 180 top
RIN_B  93.64,45.97 0 top
RM_B  104.22,113.44 0 top
RU1_B  28.96,99.19 270 top
RU2_B  28.96,45.97 270 top
TRANSFORMER  105.44,122.21 90 top
U2  94.15,68.05 270 top
U$6  101.65,80.6 90 top
U$7  95.5,32.51 0 top
U$11  [M4_MOUNTING]  5,98.99 0 top
U$12  [M4_MOUNTING]  5,69.05 0 top
U$13  [M4_MOUNTING]  5,11.67 0 top
U$14  [M4_MOUNTING]  101.65,38.11 0 top
U$16  [M4_MOUNTING]  103.65,158.99 0 top
U$17  [M4_MOUNTING]  101.65,88.99 0 top
U$18  [M4_MOUNTING]  53.85,72.14 0 top
U$19  [M4_MOUNTING]  53.85,121.41 0 top
U$27  [M4_MOUNTING]  5,148.99 0 top

### Tracks (layer width: path | path; a pad name or v marks a point on that pad's centre or on a via)
C0_B
  Top 0.254: U2.26 98.34,62.8 98.72,62.41 98.72,59.69 C_5.1 97.19,58.17 R2_B.2
C1_B  (via drill 0.38)
  Top 0.254: U2.24 88.69,62.3 87.29,60.9 87.29,15.48 v84.23,12.42 | v21.59,2.54 21.46,2.67 DRAIN1:C.1 12.78,3.43 12.78,5.16 DRAIN1:R.2
  Bottom 0.254: v84.23,12.42 83.37,11.56 57.23,11.56 48.21,2.54 v21.59,2.54
C2_B
  Top 0.254: U2.22 88.18,63.3 86.02,61.14 86.02,34.97 84.15,33.1 79.35,33.1 78.09,31.84 DRAIN2:R.2 DRAIN2:C.1
C3_B  (via drill 0.38)
  Top 0.254: U2.20 87.67,64.3 84.08,60.7 84.08,41.03 v85.3,39.81 | DRAIN3:R.2 DRAIN3:C.1 34.55,17.94 v35.66,17.94
  Bottom 0.254: v35.66,17.94 87.75,17.94 90.3,20.48 90.3,36.54 87.03,39.81 v85.3,39.81
C4_B
  Top 0.254: DRAIN4:R.2 78.02,60.07 77.93,60.15 | DRAIN4:C.1 71.37,58.67 72.85,60.15 77.93,60.15 | 77.93,60.15 81.28,60.15 86.42,65.3 U2.18
C5_B  (via drill 0.38)
  Top 0.254: U2.16 91.88,66.3 v92.63,67.04 | v44.96,40.12 44.12,40.12 DRAIN5:C.1 DRAIN5:R.2
  Bottom 0.254: v44.96,40.12 59.96,40.12 63.89,44.05 87.36,44.05 89.32,46.02 89.32,63.74 v92.63,67.04
C7_B
  Top 0.254: 78.14,86.87 82.22,86.87 83.31,85.78 83.31,71.94 83.98,71.28 83.98,70.33 86.01,68.3 U2.12 | 78.14,86.87 73.06,86.87 DRAIN6:C.1 | DRAIN6:R.2 78.14,86.87
C8_B  (via drill 0.38)
  Top 0.254: U2.10 87.8,69.3 85.99,71.1 v85.17,71.1 | v37.24,71.21 34.62,71.21 DRAIN7:C.1 DRAIN7:R.2
  Bottom 0.254: v85.17,71.1 82.55,71.1 80.25,73.41 59.94,73.41 57.15,76.2 51.05,76.2 45.96,71.1 37.34,71.1 v37.24,71.21
C9_B
  Top 0.254: DRAIN8:C.1 DRAIN8:R.2 77.89,113.28 83.19,113.28 84.64,111.82 84.64,74.08 88.44,70.3 U2.8
C10_B  (via drill 0.38)
  Top 0.254: DRAIN9:R.2 DRAIN9:C.1 44.15,93.3 v46.74,93.3 | U2.6 88.94,71.3 86.74,73.5 86.74,91.06 v86.6,91.21
  Bottom 0.254: v46.74,93.3 48.43,91.61 86.2,91.61 v86.6,91.21
CC0  (via drill 0.38)
  Top 0.254: F0.P$1 61.39,5.31 v57.43,5.31
  Bottom 0.254: CELL0.P$1 77.44,5.31 v57.43,5.31
CC1  (via drill 0.38)
  Top 0.254: F1.P$1 44.54,14.21 v41.75,11.42
  Bottom 0.254: CELL1.P$1 41.74,11.43 v41.75,11.42
CC2  (via drill 0.38)
  Top 0.254: F2.P$1 61.43,25.15 v57.91,25.15
  Bottom 0.254: CELL2.P$1 65.02,25.15 v57.91,25.15
CC3  (via drill 0.38)
  Top 0.254: F3.P$1 46.55,34.16 v50.8,34.16
  Bottom 0.254: v50.8,34.16 43.18,34.16 40.77,36.58 CELL3.P$1
CC4  (via drill 0.38)
  Top 0.254: F4.P$1 59.69,51.21 59.66,51.18 v57.02,51.18
  Bottom 0.254: CELL4.P$1 66.42,51.18 v57.02,51.18
CC5  (via drill 0.38)
  Top 0.254: v50.67,60.33 46.63,60.33 F5.P$1
  Bottom 0.254: CELL5.P$1 49.78,61.21 v50.67,60.33
CC6  (via drill 0.38)
  Top 0.254: F6.P$1 61.27,78.61 v57.28,78.61
  Bottom 0.254: CELL6.P$1 69.22,78.61 v57.28,78.61
CC7  (via drill 0.38)
  Top 0.254: v50.29,87.25 46.55,87.25 F7.P$1
  Bottom 0.254: CELL7.P$1 34.92,87.25 v50.29,87.25
CC8  (via drill 0.38)
  Top 0.254: v57.15,105.16 61.44,105.16 F8.P$1
  Bottom 0.254: CELL8.P$1 71.12,105.16 v57.15,105.16
CC9  (via drill 0.38)
  Top 0.254: F9.P$1 46.54,114.17 v51.05,114.17
  Bottom 0.254: CELL9.P$1 37.21,114.17 v51.05,114.17
DRAIN1:GATE
  Top 0.254: DRAIN1:PFET.1 15.53,9.53 DRAIN1:GATE.1
DRAIN1:N$1
  Top 0.254: DRAIN1:PFET.3 18.48,5.41 20.33,3.56 22.86,3.56 | DRAIN1:DISCHARGE.1 22.86,3.56 | 22.86,3.56 21.59,4.83 DRAIN1:LED1.A
DRAIN1:N$2
  Top 0.254: DRAIN1:R1.2 DRAIN1:LED1.C
DRAIN2:GATE
  Top 0.254: DRAIN2:GATE.1 78.94,27.54 DRAIN2:PFET.1
DRAIN2:N$1
  Top 0.254: DRAIN2:LED1.A 72.9,24.38 | 72.9,24.38 DRAIN2:PFET.3 | DRAIN2:DISCHARGE.1 79.63,24.38 72.9,24.38
DRAIN2:N$2
  Top 0.254: DRAIN2:R1.2 DRAIN2:LED1.C
DRAIN3:GATE
  Top 0.254: DRAIN3:GATE.1 27.11,23.38 DRAIN3:PFET.1
DRAIN3:N$1
  Top 0.254: DRAIN3:LED1.A 35.79,25.38 DRAIN3:PFET.3 26.69,25.38 25.21,26.86 25.21,29.65 DRAIN3:DISCHARGE.1
DRAIN3:N$2
  Top 0.254: DRAIN3:R1.2 DRAIN3:LED1.C
DRAIN4:GATE
  Top 0.254: DRAIN4:GATE.1 78.94,54.21 DRAIN4:PFET.1
DRAIN4:N$1
  Top 0.254: DRAIN4:LED1.A 72.9,51.05 | DRAIN4:DISCHARGE.1 81.53,48.01 78.49,51.05 72.9,51.05 | DRAIN4:PFET.3 72.9,51.05
DRAIN4:N$2
  Top 0.254: DRAIN4:R1.2 DRAIN4:LED1.C
DRAIN5:GATE
  Top 0.254: DRAIN5:GATE.1 27.11,50.05 DRAIN5:PFET.1
DRAIN5:N$1
  Top 0.254: DRAIN5:LED1.A 35.77,52.04 28.97,52.04 DRAIN5:PFET.3 26.69,52.05 25.15,53.59 DRAIN5:DISCHARGE.1
DRAIN5:N$2
  Top 0.254: DRAIN5:LED1.C DRAIN5:R1.2
DRAIN6:GATE
  Top 0.254: DRAIN6:GATE.1 78.94,80.88 DRAIN6:PFET.1
DRAIN6:N$1
  Top 0.254: DRAIN6:LED1.A DRAIN6:PFET.3 76.57,78.88 DRAIN6:DISCHARGE.1
DRAIN6:N$2
  Top 0.254: DRAIN6:LED1.C DRAIN6:R1.2
DRAIN7:GATE
  Top 0.254: DRAIN7:GATE.1 27.11,76.72 DRAIN7:PFET.1
DRAIN7:N$1
  Top 0.254: DRAIN7:DISCHARGE.1 25.15,81.41 27.86,78.69 29.43,78.69 DRAIN7:PFET.3 35.79,78.72 DRAIN7:LED1.A
DRAIN7:N$2
  Top 0.254: DRAIN7:LED1.C DRAIN7:R1.2
DRAIN8:GATE
  Top 0.254: DRAIN8:PFET.1 77.35,105.97 DRAIN8:GATE.1
DRAIN8:N$1
  Top 0.254: DRAIN8:LED1.A DRAIN8:PFET.3 78.15,103.97 DRAIN8:DISCHARGE.1
DRAIN8:N$2
  Top 0.254: DRAIN8:R1.2 DRAIN8:LED1.C
DRAIN9:GATE
  Top 0.254: DRAIN9:GATE.1 27.11,103.27 DRAIN9:PFET.1
DRAIN9:N$1
  Top 0.254: DRAIN9:LED1.A 35.79,105.27 DRAIN9:PFET.3 28.81,105.41 26.67,105.41 25.15,106.93 DRAIN9:DISCHARGE.1
DRAIN9:N$2
  Top 0.254: DRAIN9:LED1.C DRAIN9:R1.2
DRIVE_B  (via drill 0.38)
  Top 0.254: U2.38 100.38,68.8 v100.48,68.69 | v93.39,35.8 95.15,37.56 Q2.1
  Bottom 0.254: v100.48,68.69 100.48,67.45 101.14,66.79 101.14,57.28 99.61,55.76 99.61,51.8 96.06,48.25 96.06,39.48 93.39,36.82 v93.39,35.8 93.39,34.5 95.38,32.51 U$7.P$1
IM_B  (via drill 0.38)
  Top 0.254: U2.41 96.18,70.3 95.8,70.68 95.8,79.94 90.47,85.28 90.47,96.76 v90.21,97.01 | TRANSFORMER.P$12 89.46,122.21 89.06,121.81 89.06,113.28 C3_B.2 90.3,111.37 v90.3,103.41
  Bottom 0.254: v90.21,97.01 90.3,97.1 90.3,97.11 v90.3,103.41
IP_B  (via drill 0.38)
  Top 0.254: U2.42 96.69,70.8 96.44,71.05 96.44,80.52 91.23,85.73 v91.23,93.23 | v89.11,125.63 89.69,126.21 TRANSFORMER.P$10 | R3_B.1 91.27,117.72 v91.27,118.9
  Bottom 0.254: v89.11,125.63 89.03,125.55 89.03,121.14 v91.27,118.9 91.23,118.86 v91.23,93.23
ISOSPI-M  (via drill 0.38)
  Top 0.254: v104.9,120.03 103.41,121.53 v103.14,121.53 | ISOSPI_B.P$2 105.07,110.44 RM_B.2 105.07,115.85 R5_B.2
  Bottom 0.254: v104.9,120.03 105.64,119.29 ISOSPI_B.P$2
ISOSPI-P
  Top 0.254: R4_B.2 103.37,115.85 RM_B.1 103.14,113.21 ISOSPI_B.P$1
  Bottom 0.254: ISOSPI_B.P$1 104.12,110.84 104.12,144.67
N$1
  Top 0.254: C4_B.1 87.46,123.12 88.56,124.21 TRANSFORMER.P$11
N$2
  Top 0.254: RB1_B.2 103.64,71.8 U2.44
N$4
  Top 0.254: U2.43 99.86,71.3 102.47,68.69 RB2_B.2 103.71,69.42 105.41,71.12 RB1_B.1
N$5
  Top 0.254: TRANSFORMER.P$3 104.15,126.21 102.39,124.46 102.39,118.53 R4_B.1
N$7
  Top 0.254: TRANSFORMER.P$1 105.7,121.95 105.7,118.28 R5_B.1
N$8
  Top 0.254: U2.48 97.53,81.06 92.84,85.75 J8_B.1 J7_B.1
N$9
  Top 0.254: U2.47 98.47,73.3 98.82,73.65 98.82,82.03 96.65,84.2 J6_B.1 J5_B.1
N$10
  Top 0.254: R3_B.2 92.34,113.43 C3_B.1
N$13  (via drill 0.38)
  Top 0.254: U2.46 99.1,72.8 99.82,73.51 v99.82,74.17 | J3_B.1 J4_B.1 100.11,93.77 97.71,91.36 97.71,85.55 v98.17,85.09
  Bottom 0.254: v99.82,74.17 98.17,75.82 v98.17,85.09
N$16
  Top 0.254: U2.45 99.61,72.3 106.17,78.86 J1_B.1 J2_B.1
S1_B  (via drill 0.38)
  Top 0.254: U2.25 97.53,60.9 96.82,60.18 90.85,60.18 87.93,57.26 87.93,13.46 85.89,11.43 85.89,10.14 76.77,1.01 v15.99,1.01 | DRAIN1:GATE.2 11.66,9.53 10.06,7.92 v10.06,1.63
  Bottom 0.254: v10.06,1.63 10.68,1.01 v15.99,1.01
S2_B
  Top 0.254: U2.23 88.44,62.8 86.66,61.02 86.66,34.71 83.78,31.84 DRAIN2:GATE.2
S3_B  (via drill 0.38)
  Top 0.254: U2.21 87.93,63.8 85.26,61.13 85.26,41.05 v85.3,41.01 | v41.6,16.87 25.46,16.87 DRAIN3:GATE.2
  Bottom 0.254: v41.6,16.87 87.42,16.87 90.93,20.38 90.93,37 87.56,40.37 85.94,40.37 v85.3,41.01
S4_B
  Top 0.254: U2.19 87.4,64.8 81.53,58.93 DRAIN4:GATE.2
S5_B  (via drill 0.38)
  Top 0.254: U2.17 92.37,65.8 92.75,65.41 v92.75,64.63 | v41.66,39.75 39,42.41 26.59,42.41 DRAIN5:GATE.2 | v91.71,35.75 89.62,35.75 v89.59,35.79 | v90.9,55.81 90.9,45.42 v91.31,45.01
  Bottom 0.254: v92.75,64.63 92.75,63.74 90.86,61.85 90.9,61.81 v90.9,55.81 | v41.66,39.75 43.41,38 63.5,38 67.41,41.91 78.95,41.91 85.07,35.79 v89.59,35.79 | v91.71,35.75 91.47,35.99 91.47,44.85 v91.31,45.01
S7_B
  Top 0.254: DRAIN6:GATE.2 82.46,85.18 82.68,84.96 82.68,71.78 83.58,70.88 83.58,70.09 85.88,67.8 U2.13
S8_B  (via drill 0.38)
  Top 0.254: v85.61,69.95 86.77,68.8 U2.11 | DRAIN7:GATE.2 26.12,71.79 v26.45,71.46
  Bottom 0.254: v85.61,69.95 82.55,69.95 79.91,67.31 52.07,67.31 49.42,69.95 27.96,69.95 v26.45,71.46
S9_B
  Top 0.254: U2.9 88.05,69.8 83.95,73.9 83.95,110.36 82.46,111.85 DRAIN8:GATE.2
S10_B  (via drill 0.38)
  Top 0.254: U2.7 88.69,70.8 86.03,73.45 86.03,90.17 v85.4,90.81 | v41.79,92.83 41.79,92.86 38.67,95.97 26.24,95.97 DRAIN9:GATE.2
  Bottom 0.254: v41.79,92.83 41.82,92.83 43.67,90.97 85.24,90.97 v85.4,90.81
SENSE1  (via drill 0.38)
  Top 0.254: v57.43,12.83 58.8,14.21 F1.P$2 71.32,14.21 DRAIN2:R1.1 74.3,17.18 74.3,20.31 DRAIN2:DISCHARGE.2 | DRAIN1:R.1 15.25,7.8 v15.25,7.92 v15.24,7.92 15.82,7.92 DRAIN1:PFET.2
  Bottom 0.254: v57.43,12.83 47.77,3.17 23.5,3.17 18.75,7.92 v15.24,7.92
SENSE2
  Top 0.254: DRAIN2:R.1 75.35,29.03 73.44,29.03 DRAIN2:PFET.2 70.48,26.08 70.48,24.13 67.95,21.59 55.05,21.59 51.44,25.21 F2.P$2 44.73,25.21 DRAIN3:R1.1 33.62,33.11 DRAIN3:DISCHARGE.2
SENSE3  (via drill 0.38)
  Top 0.254: v41.02,23.39 v41.01,23.38 DRAIN3:PFET.2 28.96,22.43 DRAIN3:R.1 | v53.21,28.96 58.46,34.21 F3.P$2 64.65,34.21 DRAIN4:R1.1 74.93,44.49 74.93,45.72 DRAIN4:DISCHARGE.2
  Bottom 0.254: v53.21,28.96 47.65,23.39 v41.02,23.39
SENSE4
  Top 0.254: DRAIN4:R.1 75.25,55.61 73.93,55.61 72.54,54.21 DRAIN4:PFET.2 71.14,55.02 57.51,55.02 53.7,51.21 F4.P$2 45.4,51.21 DRAIN5:R1.1 33.62,59.78 DRAIN5:DISCHARGE.2
SENSE5  (via drill 0.38)
  Top 0.254: v42.04,50.16 41.96,50.09 37.3,50.09 DRAIN5:R.1 RU2_B.1 28.96,49.1 DRAIN5:PFET.2 | v53.98,54.99 59.19,60.21 F5.P$2 63.98,60.21 DRAIN6:R1.1 76.46,72.69 DRAIN6:DISCHARGE.2
  Bottom 0.254: v42.04,50.16 49.15,50.16 v53.98,54.99
SENSE6
  Top 0.254: DRAIN7:DISCHARGE.2 33.44,83.06 DRAIN7:R1.1 44.44,78.84 F6.P$2 54.04,78.84 58.42,74.46 67.06,74.46 71.95,79.35 DRAIN6:PFET.2 73,81.94 74.91,81.94 DRAIN6:R.1
SENSE7  (via drill 0.38)
  Top 0.254: v54.1,82.8 58.5,87.21 60.83,87.21 | 60.83,87.21 F7.P$2 | 60.83,87.21 61.17,86.87 63.97,86.87 DRAIN8:R1.1 74.93,97.83 74.93,99.06 DRAIN8:DISCHARGE.2 | DRAIN7:R.1 30.41,74.95 DRAIN7:PFET.2 30.48,76.66 v40.92,76.66
  Bottom 0.254: v40.92,76.66 47.95,76.66 v54.1,82.8
SENSE8
  Top 0.254: DRAIN9:DISCHARGE.2 33.62,112.99 DRAIN9:R1.1 36.83,112.83 44.45,105.21 F8.P$2 52.98,105.21 56.39,108.61 69.3,108.61 DRAIN8:PFET.2 71.95,108.78 73.32,110.15 DRAIN8:R.1
UNUSED1_B  (via drill 0.38)
  Top 0.254: U2.4 89.56,72.3 87.67,74.18 87.67,75.65 | RU1_B.2 31,98.34 v31.19,98.15 | v87.43,93.47 87.67,93.23 87.67,75.65 | U2.2 90.03,73.3 87.67,75.65
  Bottom 0.254: v31.19,98.15 31.95,97.38 83.52,97.38 v87.43,93.47
UNUSED2_B  (via drill 0.38)
  Top 0.254: U2.14 86.6,67.3 v84.07,64.77 | v41.78,51.69 41.33,51.23 34.98,51.23 v31.45,47.7 | RU2_B.2 28.28,45.12 v26.31,47.09
  Bottom 0.254: v41.78,51.69 46.7,56.6 52.21,56.6 60.38,64.77 v84.07,64.77 | v31.45,47.7 26.92,47.7 v26.31,47.09
V+_B
  Top 0.254: C6_B.1 R1_B.2 90.78,76.34 U2.1
V-_A  (via drill 0.38)  (1 unrouted)
  Top 0.254: v54.1,109.35 58.96,114.21 F9.P$2 | R1_B.1 90.93,79.28 v90.18,80.03 | v41.91,104.39 40.78,103.27 DRAIN9:PFET.2 28.96,102.32 RU1_B.1 DRAIN9:R.1 | RIN_B.1 92.12,46.65 v92.12,52.18 | 54.07,114.21 F9.P$2 | 64.64,114.21 F9.P$2
  Bottom 0.254: v92.12,52.18 92.12,62.22 94.4,64.5 94.4,70.82 90.18,75.04 v90.18,80.03 | v41.91,104.39 46.86,109.35 v54.1,109.35
V-_B  (via drill 0.38)  (3 unrouted)
  Top 0.254: RB2_B.1 C2_B.2 C1_B.2 105.41,60.9 104.17,59.66 | U2.31 U2.30 | U2.31 98.34,65.3 98.85,64.79 98.85,63.36 102.55,59.66 104.17,59.66 | U2.31 95.77,65.3 94.53,66.53 94.53,74.03 95.17,74.66 95.17,77.22 94.19,78.19 C6_B.2 93.98,79.76 89.26,84.48 v89.26,89.05 v89.25,89.05 89.25,98.09 | 101.47,98.16 97.41,98.16 | 93.73,98.16 97.41,98.16 | 101.47,98.16 105.3,98.16 v106.17,97.28 J1_B.2 | v48.13,41.7 48.36,41.7 48.32,41.66 45.41,41.66 40.25,46.82 DRAIN5:C.2 | 88.69,43.8 v88.69,36.7 88.69,12.49 v87.63,11.43 | 51.02,94.61 47.5,94.61 41.97,100.14 39.22,100.14 DRAIN9:C.2 | v95.25,43.81 95.25,44.07 99.94,48.76 101.41,48.76 102.16,48.01 C8_B.2 102.4,47.95 C7_B.2 | 89.25,98.09 89.25,108.45 89.2,108.51 | 89.2,108.51 v89.2,108.71 | v84.89,114.47 84.84,114.52 70.92,114.52 69.49,113.1 69.49,111.51 70.85,110.15 DRAIN8:C.2 | v71.8,89.81 70.89,89.81 66.55,85.47 v66.55,83.8 67.41,82.93 70.83,82.93 DRAIN6:C.2 | C4_B.2 87.46,110.25 89.2,108.51 | 70.48,33.78 70.42,33.72 69.48,32.78 69.48,30.47 69.81,30.14 DRAIN2:C.2 | v84.96,37.34 84.96,35.81 82.93,33.78 76.54,33.78 74.76,35.56 73.66,35.56 72.9,35.56 72.26,35.56 70.48,33.78 | 93.73,98.16 89.32,98.16 89.25,98.09 | 70.48,33.78 66.67,33.78 v66.55,33.66 | DRAIN1:C.2 11.85,1.27 11.04,0.46 9.35,0.46 8.65,1.15 8.65,9.38 11.43,12.15 DRAIN1:R1.1 22.86,10.88 22.86,6.35 24.13,5.08 28.7,5.08 DRAIN1:DISCHARGE.2 31.88,5.21 F0.P$2 50.8,5.21 54.48,8.89 82.55,8.89 v85.09,11.43 | 88.69,43.8 88.69,55 91.86,58.17 R2_B.1 93.39,56.81 C_5.2 101.32,56.81 104.17,59.66 | 88.69,43.8 v92.25,43.8 | J7_B.2 94.74,97.14 93.73,98.16 | 97.41,98.16 98.55,97.01 J5_B.2
  Top 0.254: J3_B.2 102.36,97.27 101.47,98.16 | 56.05,88.86 v57.15,87.76 | 56.05,34.89 v56.21,34.72 | 34.04,20.49 DRAIN3:C.2 | DRAIN7:C.2 34.96,74.42 v47.5,74.42 | DRAIN4:C.2 71.08,56.52 v66.04,56.52
  Bottom 0.254: v84.96,37.34 88.05,37.34 v88.69,36.7 | v48.13,41.7 48.13,47.75 56.9,56.52 v66.04,56.52 | v47.5,74.42 47.72,74.42 50.78,77.49 52.72,77.49 58.17,82.93 | v57.15,87.76 57.15,83.95 58.17,82.93 | v95.25,43.81 95.24,43.8 v92.25,43.8 | v89.2,108.71 89.2,110.16 v84.89,114.47 | v71.8,89.81 71.82,89.8 88.51,89.8 v89.26,89.05 | v66.55,33.66 57.28,33.66 v56.21,34.72 | v66.55,83.8 65.68,82.93 58.17,82.93 | v106.17,97.28 106.17,85.12 U$6.P$1 | v85.09,11.43 v87.63,11.43
VIN_B
  Top 0.254: 91.44,39.86 Q2.2 100.7,44.09 C7_B.1 | Q2.4 91.44,39.86 | RIN_B.2 94.49,42.92 91.44,39.86
VREF1_B
  Top 0.254: U2.35 100.63,67.3 102.41,65.52 C2_B.1
VREF2_B  (via drill 0.38)
  Top 0.254: U2.34 99.86,66.8 v100.31,66.34 103.71,62.94 C1_B.1
  Bottom 0.254: 100.37,66.28 v100.31,66.34
VREG_B  (via drill 0.38)
  Top 0.254: U2.40 96.56,69.8 | 96.56,69.8 96.17,69.41 96.17,68.69 96.56,68.3 U2.37 U2.36 101.14,67.8 v101.77,67.17 | J4_B.2 v100.46,96.77 | 96.56,69.8 96.62,69.85 v98.93,69.85 | J8_B.2 v92.84,96.77 | J2_B.2 104.27,96.65 v104.14,96.77 | J6_B.2 v96.65,96.77 | C8_B.1 100.75,46.79 v98.04,44.08 98.04,43.73 Q2.3
  Bottom 0.254: v101.77,67.17 101.77,47.81 v98.04,44.08 | v104.14,96.77 v100.46,96.77 96.9,96.77 | 96.9,96.77 96.9,75.69 98.93,73.66 v98.93,69.85 | v92.84,96.77 v96.65,96.77 96.9,96.77

### Text on the board
tDocu: TS | isoSPI | TS | isoSPI | 8 | 7 | x8 | x4 | x2 | x1 | 1 | 0 | 1 | 0 | 1 | 0 | 1 | 0 | 6 | V-_B | 5 | 4 | 3 | DRIVE_B | 2 | 1 | HyTech Racing 2020 / BMS Segment rev14 / Designed by Arvind Srinivasan, / based on rev10 by Yvonne Yeh | 0 | # | - | Cell 0
bDocu: TS | isoSPI | TS | isoSPI